# EasyEDA Pro project 无线充电接收端.epro, board 无线充电接收V2.1
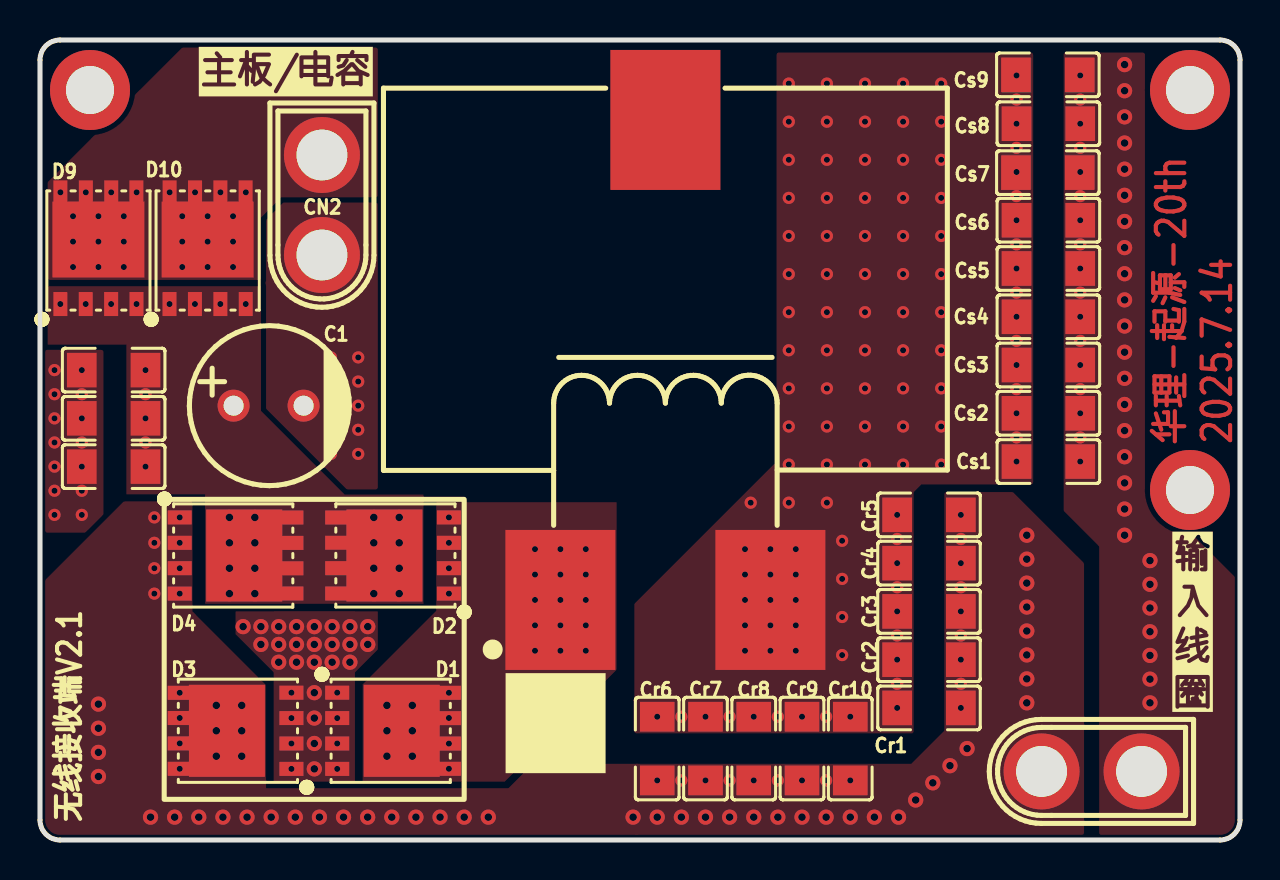
[diagram p10: board, top side]
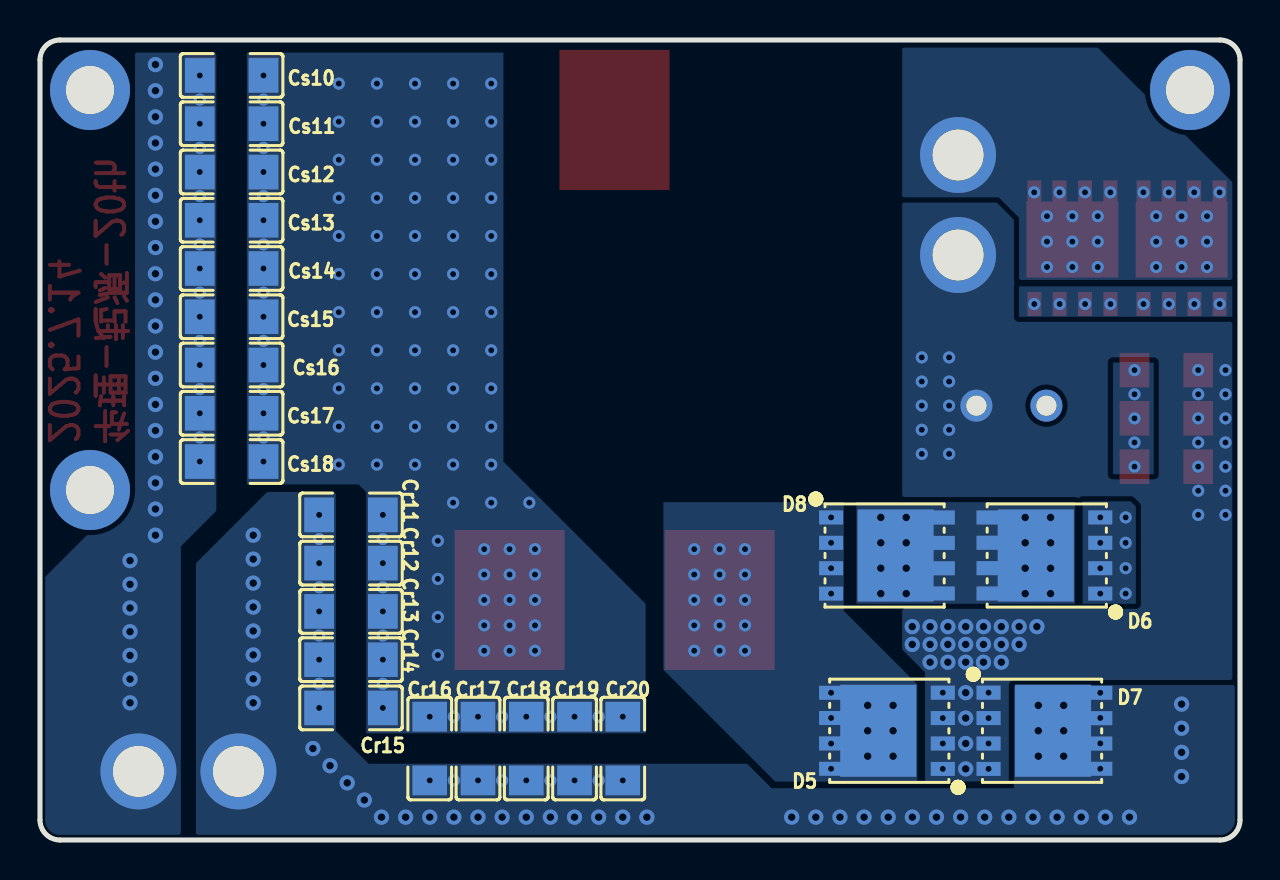
[diagram p11: board, bottom side, seen from below]

Outline 60 x 40 mm; copper layers: Top Layer, Inner1, Inner2, Bottom Layer. Coordinates in mm from the lower left corner of the outline.
Outline path: 0,39 0,1 arc(0.29,0.29) 1,0 59,0 arc(59.71,0.29) 60,1 60,39 arc(59.71,39.71) 59,40 1,40 arc(0.29,39.71) 0,39
Stack: Top Layer 0.035mm 外层铜厚1oz / Dielectric1 0.2104mm 7628 RC49% 8.6mil / Inner1 0.0152mm 内层铜厚 / Dielectric2 1.065mm 1.1mm H/HOZ Copper / Inner2 0.0152mm 内层铜厚 / Dielectric3 0.2104mm 7628 RC49% 8.6mil / Bottom Layer 0.035mm 外层铜厚1oz

## Design rules (mm)
template: xyf_v1.1
spacing copperThickness1oz (default): track to track 0.102, other pairs 0.152 to 0.3
spacing copperThickness2oz: track to track 0.203, other pairs 0.152 to 0.3
spacing 0焊盘板框间距: track to track 0.152, other pairs 0 to 0.3
spacing copperThicknessInner0.5oz: track to track 0.089, other pairs 0.152 to 0.3
track width copperThickness1oz (default): min 0.127, default 0.254, max 2.54
track width copperThickness2oz: min 0.203, default 0.254, max 2.54
track width copperThickness0.5oz: min 0.089, default 0.254, max 2.54
differential pair differentialPair (default): width min 0.127, default 0.254, max 2.54; gap min 0.152, default 0.152
via viaSize (default): diameter min 0.5, default 0.61, max 10; hole min 0.3, default 0.305, max 6.3
via viaSize2: diameter min 0.5, default 0.61, max 10; hole min 0.3, default 0.305, max 6.299
via viaSize4: diameter min 0.45, default 0.61, max 10; hole min 0.3, default 0.305, max 6.299

## Placement (name value [footprint] x y rotation side)
C1  680uF  [CAP-TH_BD8.0-P3.50-D0.6-FD]  11.43 21.72 0 top
C2  100nF  [C1206]  3.68 23.5 0 top
C3  100nF  [C1206]  3.68 21.08 0 top
C4  100nF  [C1206]  3.68 18.67 0 top
CN1  XT30U-M  [CONN-TH_XT30U-M]  52.58 3.43 180 top
CN2  XT30U-M  [CONN-TH_XT30U-M]  14.1 31.75 270 top
Cr1  68nF  [C1206]  44.45 6.6 0 top
Cr2  68nF  [C1206]  44.45 9.02 0 top
Cr3  68nF  [C1206]  44.45 11.43 0 top
Cr4  10nF  [C1206]  44.45 13.84 180 top
Cr5  10nF  [C1206]  44.45 16.26 180 top
Cr6  10nF  [C1206]  30.86 4.57 90 top
Cr7  10nF  [C1206]  33.27 4.57 90 top
Cr8  4.3nF  [C1206]  35.69 4.57 90 top
Cr9  4.3nF  [C1206]  38.1 4.57 90 top
Cr10  1nF  [C1206]  40.51 4.57 90 top
Cr11  68nF  [C1206]  44.45 16.26 0 bottom
Cr12  68nF  [C1206]  44.45 13.84 0 bottom
Cr13  68nF  [C1206]  44.45 11.43 0 bottom
Cr14  10nF  [C1206]  44.45 9.02 180 bottom
Cr15  10nF  [C1206]  44.45 6.6 180 bottom
Cr16  10nF  [C1206]  40.51 4.57 90 bottom
Cr17  10nF  [C1206]  38.1 4.57 90 bottom
Cr18  4.3nF  [C1206]  35.69 4.57 90 bottom
Cr19  4.3nF  [C1206]  33.27 4.57 90 bottom
Cr20  1nF  [C1206]  30.86 4.57 90 bottom
Cs1  10nF  [C1206]  50.42 18.92 0 top
Cs2  10nF  [C1206]  50.42 21.34 0 top
Cs3  10nF  [C1206]  50.42 23.75 0 top
Cs4  4.3nF  [C1206]  50.42 26.16 0 top
Cs5  4.3nF  [C1206]  50.42 28.58 0 top
Cs6  4.3nF  [C1206]  50.42 30.99 0 top
Cs7  1nF  [C1206]  50.39 33.37 0 top
Cs8  1nF  [C1206]  50.42 35.81 0 top
Cs9  1nF  [C1206]  50.39 38.26 0 top
Cs10  10nF  [C1206]  50.42 38.23 0 bottom
Cs11  10nF  [C1206]  50.42 35.81 0 bottom
Cs12  10nF  [C1206]  50.42 33.4 0 bottom
Cs13  4.3nF  [C1206]  50.42 30.99 0 bottom
Cs14  4.3nF  [C1206]  50.42 28.58 0 bottom
Cs15  4.3nF  [C1206]  50.42 26.16 0 bottom
Cs16  1nF  [C1206]  50.42 23.75 0 bottom
Cs17  1nF  [C1206]  50.42 21.34 0 bottom
Cs18  1nF  [C1206]  50.42 18.92 0 bottom
D1  STPS30M100DJF-TR  [PDFN-8_L5.8-W4.9-P1.27-LS6.1-BL]  17.65 5.46 270 top
D2  STPS30M100DJF-TR  [PDFN-8_L5.8-W4.9-P1.27-LS6.1-BL]  17.65 14.22 90 top
D3  STPS30M100DJF-TR  [PDFN-8_L5.8-W4.9-P1.27-LS6.1-BL]  9.78 5.46 90 top
D4  STPS30M100DJF-TR  [PDFN-8_L5.8-W4.9-P1.27-LS6.1-BL]  9.78 14.22 270 top
D5  STPS30M100DJF-TR  [PDFN-8_L5.8-W4.9-P1.27-LS6.1-BL]  17.65 5.46 90 bottom
D6  STPS30M100DJF-TR  [PDFN-8_L5.8-W4.9-P1.27-LS6.1-BL]  17.65 14.22 270 bottom
D7  STPS30M100DJF-TR  [PDFN-8_L5.8-W4.9-P1.27-LS6.1-BL]  9.78 5.46 270 bottom
D8  STPS30M100DJF-TR  [PDFN-8_L5.8-W4.9-P1.27-LS6.1-BL]  9.78 14.22 90 bottom
D9  STPS30M100DJF-TR  [PDFN-8_L5.8-W4.9-P1.27-LS6.1-BL]  2.92 29.59 0 top
D10  STPS30M100DJF-TR  [PDFN-8_L5.8-W4.9-P1.27-LS6.1-BL]  8.38 29.59 0 top
L1  4.7uH  [IND-SMD_3P-L28.0-W19.0-LS27.0]  31.27 24 0 top
QR1  -  [JLC-QRCODE-5x5]  25.78 5.84 0 top
SCREW1  -  [M2螺丝（2.35）]  2.5 37.5 0 top
SCREW2  -  [M2螺丝（2.35）]  57.5 37.5 0 top
SCREW4  -  [M2螺丝（2.35）]  57.5 17.5 0 top

## Footprints (pads in the part's own frame, mm; a bottom-side part is the same pattern mirrored in y, then rotated)
C1206
  rect 1.485x1.728 smd: 1(-1.593,0) 2(1.593,0)
CAP-TH_BD8.0-P3.50-D0.6-FD
  round 1.6 hole 1: 1(-1.75,0) 2(1.75,0)
CONN-TH_XT30U-M
  round 3.8 hole 2.54: 1(-2.5,0) 2(2.5,0)
IND-SMD_3P-L28.0-W19.0-LS27.0
  rect 5.5x7 smd: 1(-5.25,-12) 2(5.25,-12) 3(0,12)
M2螺丝（2.35）
  round 4 hole 2.4x2.35: 1(0,0)
PDFN-8_L5.8-W4.9-P1.27-LS6.1-BL
  rect 0.7x1.2 smd: 1(-1.905,-2.792) 2(-0.635,-2.792) 3(0.635,-2.792) 4(1.905,-2.792) 5(1.9,2.792) 6(0.64,2.792) 7(-0.63,2.792) 8(-1.9,2.792)
  rect 4.6x3.8 smd: 9(0,0.432)

## Nets
As in the schematic.

Pads without a net: L1 3; SCREW1 1; SCREW2 1; SCREW4 1

## Via types
v1: diameter 0.762, hole 0.381, Top Layer to Bottom Layer, 121 vias
v2: diameter 0.61, hole 0.305, Top Layer to Bottom Layer, 253 vias

## Routing (per net, layer and track width the routed paths; a pad name or vN(x,y) marks a point on that pad's centre or on a via; arc(x,y) is an arc through that point)
GND:
  vias: v1(10.16,10.67) v1(11.04,10.67) v1(11.04,9.78) v1(11.94,10.67) v1(11.94,9.78) v1(11.94,8.89) v1(12.83,10.67) v1(12.83,9.78) v1(12.83,8.89) v1(13.72,10.67) v1(13.72,9.78) v1(13.72,8.89) v1(13.72,7.37) v1(13.72,6.1) v1(13.72,4.83) v1(13.72,3.56) v1(14.61,10.67) v1(14.61,9.78) v1(14.61,8.89) v1(15.5,10.67) v1(15.5,9.78) v1(15.5,8.89) v1(16.39,10.67) v1(16.39,9.78) v2(0.72,23.5) v2(0.72,22.29) v2(0.72,21.08) v2(0.72,19.88) v2(0.72,18.67) v2(0.72,17.46) v2(0.72,16.26) v2(2.09,23.5) v2(2.09,22.29) v2(2.09,21.08) v2(2.09,19.88) v2(2.09,18.67) v2(2.09,17.46) v2(2.09,16.26) v2(12.57,7.37) v2(12.57,6.1) v2(12.57,4.83) v2(12.57,3.56) v2(14.55,24.13) v2(14.55,22.92) v2(14.55,21.72) v2(14.55,20.51) v2(14.55,19.3) v2(14.86,7.37) v2(14.86,6.1) v2(14.86,4.83) v2(14.86,3.56) v2(15.91,24.13) v2(15.91,22.92) v2(15.91,21.72) v2(15.91,20.51) v2(15.91,19.3)
VCAP:
  vias: v2(1.02,32.38) v2(1.65,31.19) v2(1.65,29.92) v2(1.65,28.65) v2(2.29,32.38) v2(2.92,31.19) v2(2.92,29.92) v2(2.92,28.65) v2(3.56,32.38) v2(4.19,31.19) v2(4.19,29.92) v2(4.19,28.65) v2(4.83,32.38) v2(6.48,32.38) v2(7.11,31.19) v2(7.11,29.92) v2(7.11,28.65) v2(7.75,32.38) v2(8.38,31.19) v2(8.38,29.92) v2(8.38,28.65) v2(9.02,32.38) v2(9.65,31.19) v2(9.65,29.92) v2(9.65,28.65) v2(10.29,32.38)
$1N505:
  vias: v1(2.92,6.79) v1(2.92,5.59) v1(2.92,4.38) v1(2.92,3.17) v1(5.53,1.14) v1(6.73,1.14) v1(7.94,1.14) v1(8.82,6.73) v1(8.82,5.46) v1(8.82,4.19) v1(9.15,1.14) v1(10.09,6.73) v1(10.09,5.46) v1(10.09,4.19) v1(10.35,1.14) v1(11.56,1.14) v1(12.76,1.14) v1(13.97,1.14) v1(15.18,1.14) v1(16.38,1.14) v1(17.59,1.14) v1(18.8,1.14) v1(20,1.14) v1(21.21,1.14) v1(22.42,1.14) v1(29.66,1.14) v1(30.86,1.14) v1(32.07,1.14) v1(33.27,1.14) v1(34.48,1.14) v1(35.69,1.14) v1(36.89,1.14) v1(38.1,1.14) v1(39.31,1.14) v1(40.51,1.14) v1(41.72,1.14) v1(42.93,1.14) v1(43.78,2) v1(44.64,2.86) v1(45.5,3.72) v1(46.35,4.57) v1(49.34,15.24) v1(49.34,14.04) v1(49.34,12.84) v1(49.34,11.65) v1(49.34,10.45) v1(49.34,9.25) v1(49.34,8.06) v1(49.34,6.86) v2(5.72,16.13) v2(5.72,14.86) v2(5.72,13.59) v2(5.72,12.32) v2(6.99,16.13) v2(6.99,14.86) v2(6.99,13.59) v2(6.99,12.32) v2(6.99,7.36) v2(6.99,6.1) v2(6.99,4.83) v2(6.99,3.56) v2(30.86,2.98) v2(32.07,2.98) v2(33.27,2.98) v2(34.48,2.98) v2(35.69,2.98) v2(36.89,2.98) v2(38.1,2.98) v2(39.31,2.98) v2(40.51,2.98) v2(46.04,16.26) v2(46.04,15.05) v2(46.04,13.84) v2(46.04,12.64) v2(46.04,11.43) v2(46.04,10.22) v2(46.04,9.02) v2(46.04,7.81) v2(46.04,6.6)
$1N630:
  vias: v1(17.35,6.73) v1(17.35,5.46) v1(17.35,4.19) v1(18.62,6.73) v1(18.62,5.46) v1(18.62,4.19) v2(20.45,16.13) v2(20.45,14.86) v2(20.45,13.59) v2(20.45,12.32) v2(20.45,7.36) v2(20.45,6.1) v2(20.45,4.82) v2(20.45,3.56) v2(24.75,14.54) v2(24.75,13.27) v2(24.75,12) v2(24.75,10.73) v2(24.75,9.46) v2(26.02,14.54) v2(26.02,13.27) v2(26.02,12) v2(26.02,10.73) v2(26.02,9.46) v2(27.29,14.54) v2(27.29,13.27) v2(27.29,12) v2(27.29,10.73) v2(27.29,9.46)
$1N944:
  vias: v1(9.47,16.13) v1(9.47,14.86) v1(9.47,13.59) v1(9.47,12.32) v1(10.74,16.13) v1(10.74,14.86) v1(10.74,13.59) v1(10.74,12.32) v1(16.69,16.13) v1(16.69,14.86) v1(16.69,13.59) v1(16.69,12.32) v1(17.96,16.13) v1(17.96,14.86) v1(17.96,13.59) v1(17.96,12.32) v2(1.02,26.8) v2(2.29,26.8) v2(3.56,26.8) v2(4.83,26.8) v2(5.28,23.5) v2(5.28,22.29) v2(5.28,21.08) v2(5.28,19.88) v2(5.28,18.67) v2(6.48,26.8) v2(7.75,26.8) v2(9.02,26.8) v2(10.29,26.8)
$1N10317:
  vias: v2(30.86,6.16) v2(32.07,6.16) v2(33.27,6.16) v2(34.48,6.16) v2(35.25,14.54) v2(35.25,13.27) v2(35.25,12) v2(35.25,10.73) v2(35.25,9.46) v2(35.53,16.87) v2(35.69,6.16) v2(36.52,14.54) v2(36.52,13.27) v2(36.52,12) v2(36.52,10.73) v2(36.52,9.46) v2(36.89,6.16) v2(37.44,37.82) v2(37.44,35.92) v2(37.44,34.01) v2(37.44,32.11) v2(37.44,30.2) v2(37.44,28.3) v2(37.44,26.39) v2(37.44,24.49) v2(37.44,22.58) v2(37.44,20.68) v2(37.44,18.77) v2(37.44,16.87) v2(37.79,14.54) v2(37.79,13.27) v2(37.79,12) v2(37.79,10.73) v2(37.79,9.46) v2(38.1,6.16) v2(39.34,37.82) v2(39.34,35.92) v2(39.34,34.01) v2(39.34,32.11) v2(39.34,30.2) v2(39.34,28.3) v2(39.34,26.39) v2(39.34,24.49) v2(39.34,22.58) v2(39.34,20.68) v2(39.34,18.77) v2(39.34,16.87) v2(39.31,6.16) v2(40.11,14.96) v2(40.11,13.06) v2(40.11,11.15) v2(40.11,9.25) v2(40.51,6.16) v2(41.25,37.82) v2(41.25,35.92) v2(41.25,34.01) v2(41.25,32.11) v2(41.25,30.2) v2(41.25,28.3) v2(41.25,26.39) v2(41.25,24.49) v2(41.25,22.58) v2(41.25,20.68) v2(41.25,18.77) v2(42.86,16.26) v2(42.86,15.05) v2(42.86,13.84) v2(42.86,12.64) v2(42.86,11.43) v2(42.86,10.22) v2(42.86,9.02) v2(42.86,7.81) v2(42.86,6.6) v2(43.15,37.82) v2(43.15,35.92) v2(43.15,34.01) v2(43.15,32.11) v2(43.15,30.2) v2(43.15,28.3) v2(43.15,26.39) v2(43.15,24.49) v2(43.15,22.58) v2(43.15,20.68) v2(43.15,18.77) v2(45.06,37.82) v2(45.06,35.92) v2(45.06,34.01) v2(45.06,32.11) v2(45.06,30.2) v2(45.06,28.3) v2(45.06,26.39) v2(45.06,24.49) v2(45.06,22.58) v2(45.06,20.68) v2(45.06,18.77) v2(48.83,38.23) v2(48.83,37.02) v2(48.83,35.81) v2(48.83,34.61) v2(48.83,33.4) v2(48.83,32.19) v2(48.83,30.99) v2(48.83,29.78) v2(48.83,28.58) v2(48.83,27.37) v2(48.83,26.16) v2(48.83,24.96) v2(48.83,23.75) v2(48.83,22.54) v2(48.83,21.34) v2(48.83,20.13) v2(48.83,18.92)
$1N10703:
  vias: v1(54.23,38.77) v1(54.23,37.46) v1(54.23,36.16) v1(54.23,34.85) v1(54.23,33.54) v1(54.23,32.23) v1(54.23,30.93) v1(54.23,29.62) v1(54.23,28.31) v1(54.23,27.01) v1(54.23,25.7) v1(54.23,24.39) v1(54.23,23.08) v1(54.23,21.78) v1(54.23,20.47) v1(54.23,19.16) v1(54.23,17.85) v1(54.23,16.55) v1(54.23,15.24) v1(55.5,13.97) v1(55.5,12.78) v1(55.5,11.6) v1(55.5,10.41) v1(55.5,9.23) v1(55.5,8.04) v1(55.5,6.86) v2(52.01,38.23) v2(52.01,37.02) v2(52.01,35.81) v2(52.01,34.61) v2(52.01,33.4) v2(52.01,32.19) v2(52.01,30.99) v2(52.01,29.78) v2(52.01,28.58) v2(52.01,27.37) v2(52.01,26.16) v2(52.01,24.96) v2(52.01,23.75) v2(52.01,22.54) v2(52.01,21.34) v2(52.01,20.13) v2(52.01,18.92)

## Copper pours and planes (outline as drawn; the poured copper is in the pictures)
GND on Top Layer: 11.68,11.43 15.75,11.43 15.75,2.92 11.68,2.92
GND on Top Layer: 9.78,11.43 16.89,11.43 16.89,8.38 9.78,8.38
GND on Top Layer: -0.51,41.91 16.89,41.91 16.89,15.37 -0.51,15.37
GND on Bottom Layer: 15.75,2.92 15.75,8.38 16.89,9.53 16.89,31.88 0.38,31.88 0.38,2.92
GND on Inner1: 9.78,11.43 16.89,11.43 16.89,8.38 9.78,8.38
GND on Inner1: 11.68,11.43 15.75,11.43 15.75,2.92 11.68,2.92
GND on Inner1: 0.38,24.51 3.17,24.51 3.17,15.37 0.38,15.37
GND on Inner1: 11.3,31.87 16.89,31.87 16.89,17.53 11.3,17.53
GND on Inner2: 15.75,2.92 15.75,8.38 16.89,9.53 16.89,31.88 0.38,31.88 0.38,2.92
VCAP on Top Layer: 11.05,28.01 11.05,31.11 12.06,32.13 16.89,32.13 16.89,39.62 7.11,39.62 0.38,32.89 0.38,28.01
VCAP on Bottom Layer: 11.05,28.01 11.05,31.11 12.06,32.13 16.89,32.13 16.89,39.62 7.11,39.62 0.38,32.89 0.38,28.01
VCAP on Inner1: 11.05,28.01 11.05,31.11 12.06,32.13 16.89,32.13 16.89,39.62 7.11,39.62 0.38,32.89 0.38,28.01
VCAP on Inner2: 11.05,28.01 11.05,31.11 12.06,32.13 16.89,32.13 16.89,39.62 7.11,39.62 0.38,32.89 0.38,28.01
$1N505 on Top Layer: 24.64,3.81 23.42,2.59 11.3,2.59 11.3,7.75 7.62,11.43 7.62,16.93 4.19,16.93 -1.52,11.22 -1.52,-0.63 29.97,-0.63 29.97,3.81
$1N505 on Top Layer: 52.2,-1.27 52.2,13.84 48.64,17.4 45.21,17.4 45.21,5.46 43.56,3.81 29.72,3.81 29.72,-1.27
$1N505 on Bottom Layer: 24.64,3.81 23.42,2.59 11.3,2.59 11.3,7.75 -1.52,7.75 -1.52,-0.63 29.97,-0.63 29.97,3.81
$1N505 on Bottom Layer: 5.21,16.93 7.87,16.93 7.87,11.81 5.21,11.81
$1N505 on Bottom Layer: 52.2,-1.27 52.2,13.84 48.64,17.4 45.21,17.4 45.21,5.46 43.56,3.81 29.72,3.81 29.72,-1.27
$1N505 on Inner1: 24.64,3.81 23.42,2.59 11.3,2.59 11.3,7.37 -1.52,7.37 -1.52,-0.63 29.97,-0.63 29.97,3.81
$1N505 on Inner1: 52.2,-1.27 52.2,13.84 48.64,17.4 45.21,17.4 45.21,5.46 43.56,3.81 29.72,3.81 29.72,-1.27
$1N505 on Inner1: 7.62,16.89 7.62,11.43 11.3,7.75 11.3,6.74 0.25,6.74 0.25,12.95 4.19,16.89
$1N505 on Inner2: 24.64,3.81 23.42,2.59 11.3,2.59 11.3,7.75 -1.52,7.75 -1.52,-0.63 29.97,-0.63 29.97,3.81
$1N505 on Inner2: 52.2,-1.27 52.2,13.84 48.64,17.4 45.21,17.4 45.21,5.46 43.56,3.81 29.72,3.81 29.72,-1.27
$1N505 on Inner2: 5.21,16.55 7.87,16.55 7.87,11.94 5.21,11.94
$1N630 on Top Layer: 16.13,16.89 28.83,16.89 28.83,2.92 16.13,2.92
$1N630 on Bottom Layer: 16.13,16.89 28.83,16.89 28.83,2.92 16.13,2.92
$1N630 on Inner1: 16.13,16.89 28.83,16.89 28.83,2.92 16.13,2.92
$1N630 on Inner2: 16.13,16.89 28.83,16.89 28.83,2.92 16.13,2.92
$1N944 on Top Layer: 0.38,27.69 19.18,27.69 19.18,11.81 0.38,11.81
$1N944 on Bottom Layer: 4.32,23.88 6.35,23.88 6.35,18.29 4.32,18.29
$1N944 on Bottom Layer: 8.25,16.89 19.18,16.89 19.18,11.81 8.25,11.81
$1N944 on Bottom Layer: 0.38,27.69 11.05,27.69 11.05,26.16 0.38,26.16
$1N944 on Inner1: 0.38,27.43 19.18,27.43 19.18,11.81 0.38,11.81
$1N944 on Inner2: 16.31,16.51 18.34,16.51 18.34,11.94 16.31,11.94
$1N944 on Inner2: 0.38,27.69 11.05,27.69 11.05,26.16 0.38,26.16
$1N944 on Inner2: 9.09,16.51 11.12,16.51 11.12,11.94 9.09,11.94
$1N944 on Inner2: 4.32,23.88 6.35,23.88 6.35,18.29 4.32,18.29
$1N10317 on Top Layer: 36.83,39.37 36.83,18.92 29.72,11.81 29.72,5.33 43.69,5.33 43.69,17.4 44.07,17.78 49.66,17.78 49.66,39.37
$1N10317 on Bottom Layer: 29.72,39.37 49.66,39.37 49.66,5.33 29.72,5.33
$1N10317 on Inner1: 29.72,39.37 49.66,39.37 49.66,5.33 29.72,5.33
$1N10317 on Inner2: 29.72,39.37 49.66,39.37 49.66,5.33 29.72,5.33
$1N10703 on Top Layer: 61.98,-1.14 61.98,10.92 55.25,17.65 55.25,39.37 51.18,39.37 51.18,16.46 52.96,14.68 52.96,-1.14
$1N10703 on Bottom Layer: 61.98,-1.14 61.98,10.92 55.25,17.65 55.25,39.37 51.18,39.37 51.18,16.46 52.96,14.68 52.96,-1.14
$1N10703 on Inner1: 61.98,-1.14 61.98,10.92 55.25,17.65 55.25,39.37 51.18,39.37 51.18,16.46 52.96,14.68 52.96,-1.14
$1N10703 on Inner2: 61.98,-1.14 61.98,10.92 55.25,17.65 55.25,39.37 51.18,39.37 51.18,16.46 52.96,14.68 52.96,-1.14

## Text on the board
Top Layer: 华理-起源-20th / 2025.7.14
Top Silkscreen Layer: 无线接收端V2.1 | 主板/电容 | 输 / 入 / 线 / 圈
